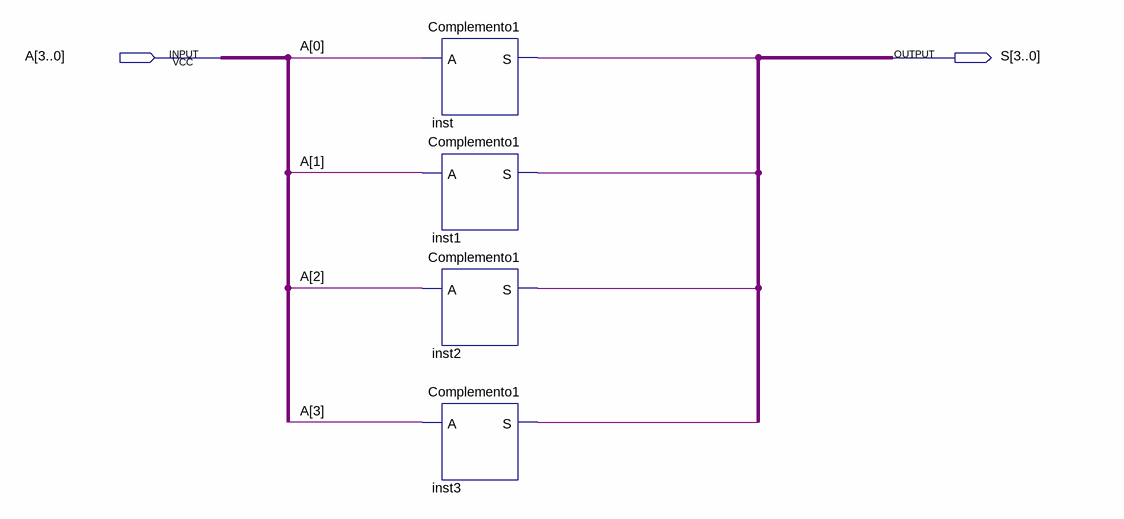
[diagram p0: schematic sheet]
// Quartus schematic Complemento1_4bits.bdf as structural Verilog: 4 symbols, 2 pins
module Complemento1_4bits (
  input  [3:0] A,
  output [3:0] S
);

  wire inst1_s, inst2_s, inst3_s, inst_s;

  Complemento1 inst (.A(A[0]), .S(inst_s));
  Complemento1 inst1 (.A(A[1]), .S(inst1_s));
  Complemento1 inst2 (.A(A[2]), .S(inst2_s));
  Complemento1 inst3 (.A(A[3]), .S(inst3_s));
endmodule
